# EAGLE schematic analogClock (EAGLE 7.3.0)
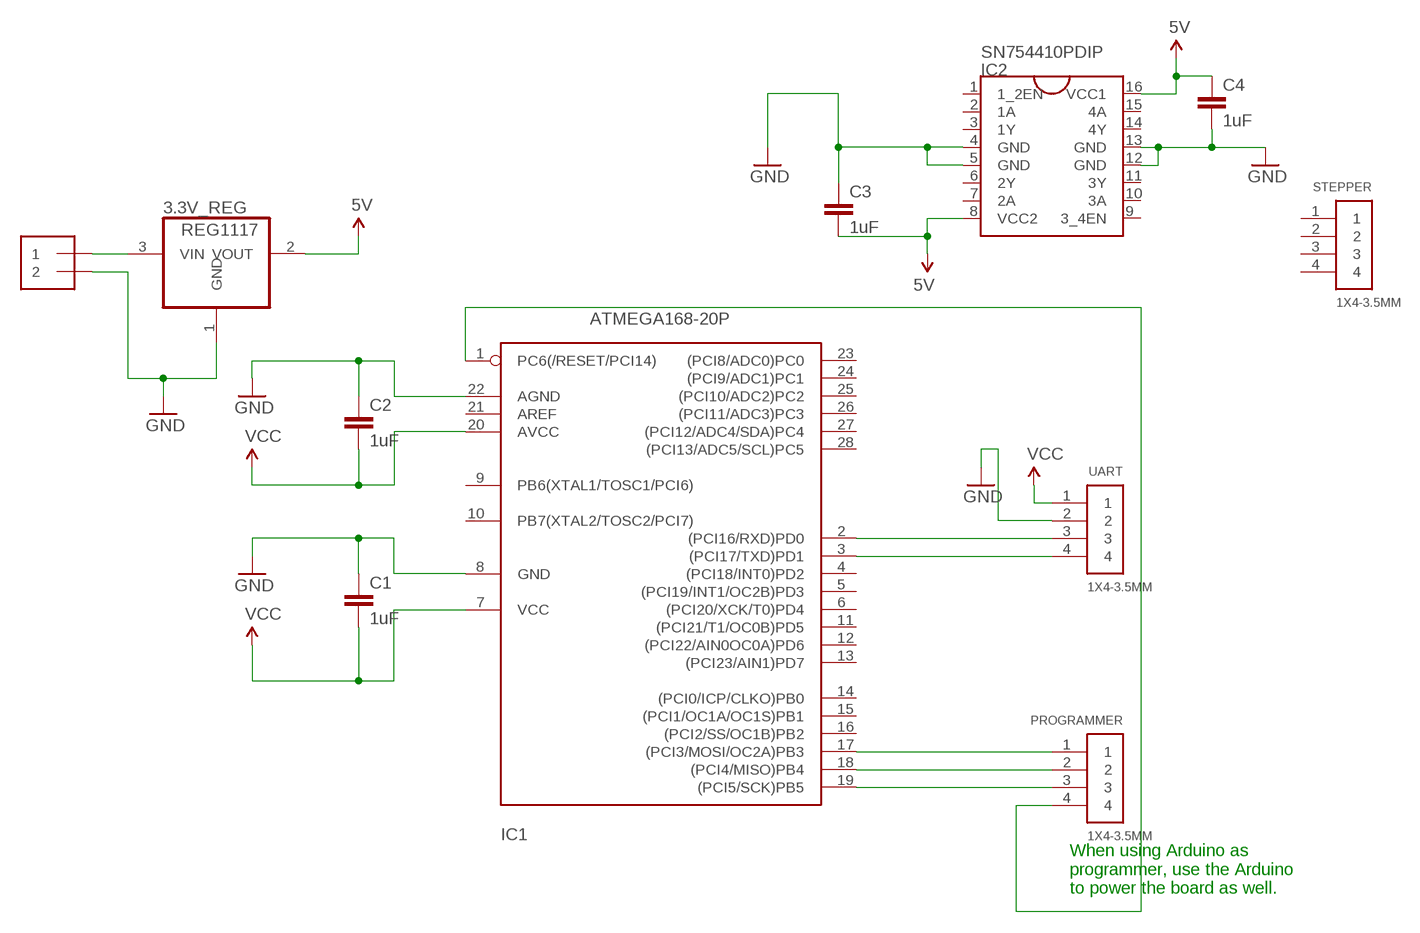
[diagram p0: schematic, sheet 1]

## Parts
3.3V_REG  REG1117  [SOT223]
C1  1uF  CAPPTH  [CAP-PTH-SMALL]
C2  1uF  CAPPTH  [CAP-PTH-SMALL]
C3  1uF  CAPPTH  [CAP-PTH-SMALL]
C4  1uF  CAPPTH  [CAP-PTH-SMALL]
IC1  ATMEGA168-20P  [DIL28-3]
IC2  SN754410PDIP  [DIL16]
POWER_IN  1X2-3.5MM  [1X2-3.5MM]
PROGRAMMER  1X4-3.5MM  [1X04-3.5MM]
STEPPER  1X4-3.5MM  [1X04-3.5MM]
UART  1X4-3.5MM  [1X04-3.5MM]

## Nets
5V [supply]: 3.3V_REG.2(VOUT) C3.2 C4.1 IC2.8(VCC2) IC2.16(VCC1)
GND [supply]: 3.3V_REG.1(GND) C1.1 C2.1 C3.1 C4.2 IC1.8(GND) IC1.22(AGND) IC2.4(GND) IC2.5(GND) IC2.12(GND) IC2.13(GND) POWER_IN.2 UART.2
MISO: IC1.18((PCI4/MISO)PB4) PROGRAMMER.2
MOSI: IC1.17((PCI3/MOSI/OC2A)PB3) PROGRAMMER.1
N$3: IC1.2((PCI16/RXD)PD0) UART.3
N$4: IC1.3((PCI17/TXD)PD1) UART.4
RESET: IC1.1(PC6(/RESET/PCI14)) PROGRAMMER.4
SCK: IC1.19((PCI5/SCK)PB5) PROGRAMMER.3
VCC [supply]: C1.2 C2.2 IC1.7(VCC) IC1.20(AVCC) UART.1
VIN [supply]: 3.3V_REG.3(VIN) POWER_IN.1
Unconnected: IC1.4((PCI18/INT0)PD2) IC1.5((PCI19/INT1/OC2B)PD3) IC1.6((PCI20/XCK/T0)PD4) IC1.9(PB6(XTAL1/TOSC1/PCI6)) IC1.10(PB7(XTAL2/TOSC2/PCI7)) IC1.11((PCI21/T1/OC0B)PD5) IC1.12((PCI22/AIN0OC0A)PD6) IC1.13((PCI23/AIN1)PD7) IC1.14((PCI0/ICP/CLKO)PB0) IC1.15((PCI1/OC1A/OC1S)PB1) IC1.16((PCI2/SS/OC1B)PB2) IC1.21(AREF) IC1.23((PCI8/ADC0)PC0) IC1.24((PCI9/ADC1)PC1) IC1.25((PCI10/ADC2)PC2) IC1.26((PCI11/ADC3)PC3) IC1.27((PCI12/ADC4/SDA)PC4) IC1.28((PCI13/ADC5/SCL)PC5) IC2.1(1_2EN) IC2.2(1A) IC2.3(1Y) IC2.6(2Y) IC2.7(2A) IC2.9(3_4EN) IC2.10(3A) IC2.11(3Y) IC2.14(4Y) IC2.15(4A) STEPPER.1 STEPPER.2 STEPPER.3 STEPPER.4

## Notes on the sheet
- When using Arduino as
  programmer, use the Arduino
  to power the board as well.

## Library data of the parts
3.3V_REG = burr-brown:REG1117: 800mA and 1A Low Dropout (LDO) Positive Regulator 1.8V, 2.5V, 2.85V, 3.3V, 5V, and Adj; MPN: REG1117; OC_FARNELL: 1097566; OC_NEWARK: 14P6981
C1-C4 = SparkFun-Capacitors:CAP: Capacitor Standard 0603 ceramic capacitor, and 0.1" leaded capacitor.
IC1 = adafruit:ATMEGA168*P: MICROCONTROLLER 16 kBytes FLASH 1 kBytes SRAM 512 Bytes EEPROM USART 8-channel 10 bit ADC
IC2 = AlexW-Eagle-Libraries:SN754410
POWER_IN = adafruit:1X2: 3.5mm Terminal block http://www.ladyada.net/library/pcb/eaglelibrary.html
PROGRAMMER STEPPER UART = adafruit:1X4: 4-pin connector

## Net classes
0 default: width 0.254 mm, clearance 0.254 mm
1 supply: width 0.508 mm, clearance 0.508 mm